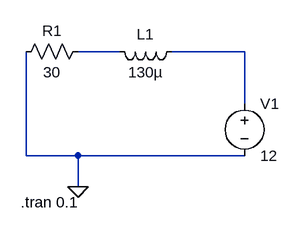
[diagram p0: schematic rl circuit.asc]
rl circuit.asc, the LTspice schematic file:
Version 4.1
SHEET 1 880 680
WIRE 320 -48 256 -48
WIRE 512 -48 400 -48
WIRE 512 32 512 -48
WIRE 176 112 176 -48
WIRE 256 112 176 112
WIRE 512 112 256 112
WIRE 256 160 256 112
FLAG 256 160 0
SYMBOL res 272 -64 R90
WINDOW 0 0 56 VBottom 2
WINDOW 3 32 56 VTop 2
SYMATTR InstName R1
SYMATTR Value 30
SYMBOL ind 416 -64 R90
WINDOW 0 5 56 VBottom 2
WINDOW 3 32 56 VTop 2
SYMATTR InstName L1
SYMATTR Value 130µ
SYMBOL voltage 512 16 R0
WINDOW 123 0 0 Left 0
WINDOW 39 0 0 Left 0
SYMATTR InstName V1
SYMATTR Value 12
TEXT 168 184 Left 2 !.tran 0.1

The netlist it stands for:
* rl circuit.asc
R1 N001 0 30
L1 N002 N001 130µ
V1 N002 0 12
.tran 0.1
.backanno
.end